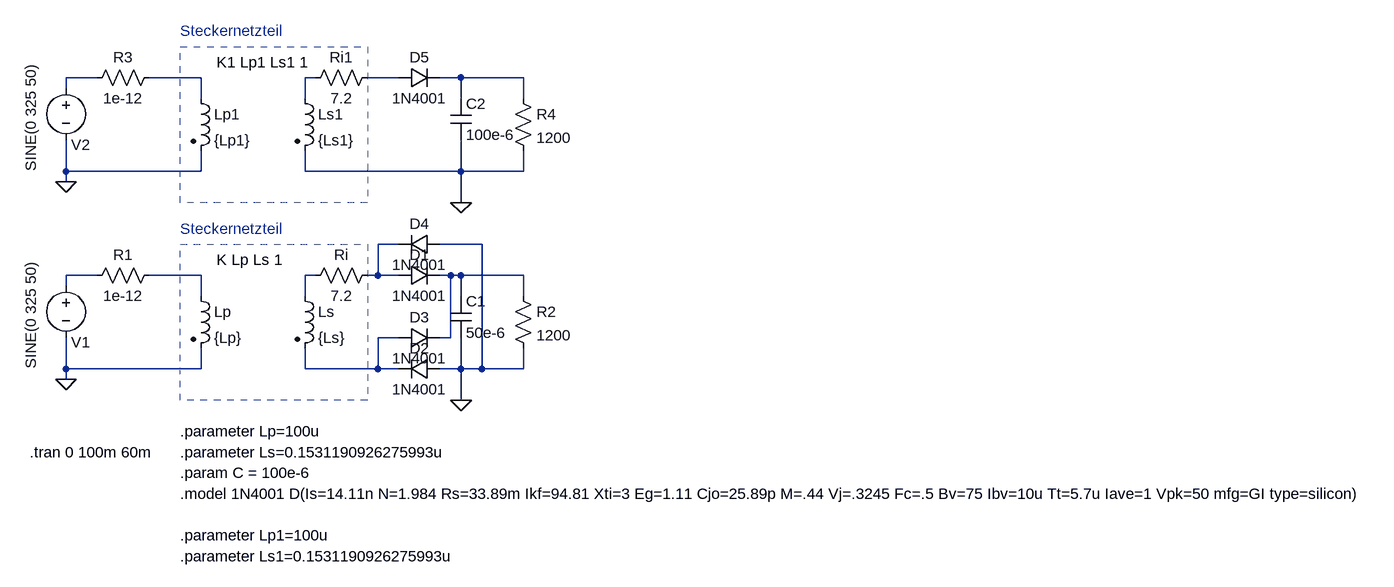
[diagram p0: schematic 102_lec_exercise_diode_bruecke.asc]
102_lec_exercise_diode_bruecke.asc, the LTspice schematic file:
Version 4
SHEET 1 2120 680
WIRE -48 -256 -96 -256
WIRE 112 -256 32 -256
WIRE 288 -256 272 -256
WIRE 416 -256 368 -256
WIRE 512 -256 480 -256
WIRE 608 -256 512 -256
WIRE -96 -240 -96 -256
WIRE 112 -224 112 -256
WIRE 272 -224 272 -256
WIRE 512 -224 512 -256
WIRE 608 -224 608 -256
WIRE -96 -112 -96 -160
WIRE 112 -112 112 -144
WIRE 112 -112 -96 -112
WIRE 272 -112 272 -144
WIRE 512 -112 512 -160
WIRE 512 -112 272 -112
WIRE 608 -112 608 -144
WIRE 608 -112 512 -112
WIRE -96 -96 -96 -112
WIRE 512 -64 512 -112
WIRE 416 0 384 0
WIRE 544 0 480 0
WIRE -48 48 -96 48
WIRE 112 48 32 48
WIRE 288 48 272 48
WIRE 384 48 384 0
WIRE 384 48 368 48
WIRE 416 48 384 48
WIRE 496 48 480 48
WIRE 512 48 496 48
WIRE 608 48 512 48
WIRE -96 64 -96 48
WIRE 112 80 112 48
WIRE 272 80 272 48
WIRE 512 80 512 48
WIRE 608 80 608 48
WIRE 416 144 384 144
WIRE 496 144 496 48
WIRE 496 144 480 144
WIRE -96 192 -96 144
WIRE 112 192 112 160
WIRE 112 192 -96 192
WIRE 272 192 272 160
WIRE 384 192 384 144
WIRE 384 192 272 192
WIRE 416 192 384 192
WIRE 512 192 512 144
WIRE 512 192 480 192
WIRE 544 192 544 0
WIRE 544 192 512 192
WIRE 608 192 608 160
WIRE 608 192 544 192
WIRE -96 208 -96 192
WIRE 512 240 512 192
FLAG -96 208 0
FLAG 512 240 0
FLAG -96 -96 0
FLAG 512 -64 0
SYMBOL voltage -96 48 R0
WINDOW 0 8 103 Left 2
WINDOW 3 -54 144 VLeft 2
WINDOW 123 0 0 Left 2
WINDOW 39 0 0 Left 2
SYMATTR InstName V1
SYMATTR Value SINE(0 325 50)
SYMBOL ind2 96 64 R0
SYMATTR InstName Lp
SYMATTR Value {Lp}
SYMATTR Type ind
SYMBOL ind2 256 64 R0
SYMATTR InstName Ls
SYMATTR Value {Ls}
SYMATTR Type ind
SYMBOL res 48 32 R90
WINDOW 0 0 56 VBottom 2
WINDOW 3 32 56 VTop 2
SYMATTR InstName R1
SYMATTR Value 1e-12
SYMBOL res 384 32 R90
WINDOW 0 0 56 VBottom 2
WINDOW 3 32 56 VTop 2
SYMATTR InstName Ri
SYMATTR Value 7.2
SYMBOL diode 416 64 R270
WINDOW 0 32 32 VTop 2
WINDOW 3 0 32 VBottom 2
SYMATTR InstName D1
SYMATTR Value 1N4001
SYMBOL cap 496 80 R0
SYMATTR InstName C1
SYMATTR Value 50e-6
SYMBOL res 592 64 R0
SYMATTR InstName R2
SYMATTR Value 1200
SYMBOL diode 480 176 R90
WINDOW 0 0 32 VBottom 2
WINDOW 3 32 32 VTop 2
SYMATTR InstName D2
SYMATTR Value 1N4001
SYMBOL diode 416 160 R270
WINDOW 0 32 32 VTop 2
WINDOW 3 0 32 VBottom 2
SYMATTR InstName D3
SYMATTR Value 1N4001
SYMBOL diode 480 -16 R90
WINDOW 0 0 32 VBottom 2
WINDOW 3 32 32 VTop 2
SYMATTR InstName D4
SYMATTR Value 1N4001
SYMBOL voltage -96 -256 R0
WINDOW 0 8 103 Left 2
WINDOW 3 -54 144 VLeft 2
WINDOW 123 0 0 Left 2
WINDOW 39 0 0 Left 2
SYMATTR InstName V2
SYMATTR Value SINE(0 325 50)
SYMBOL ind2 96 -240 R0
SYMATTR InstName Lp1
SYMATTR Value {Lp1}
SYMATTR Type ind
SYMBOL ind2 256 -240 R0
SYMATTR InstName Ls1
SYMATTR Value {Ls1}
SYMATTR Type ind
SYMBOL res 48 -272 R90
WINDOW 0 0 56 VBottom 2
WINDOW 3 32 56 VTop 2
SYMATTR InstName R3
SYMATTR Value 1e-12
SYMBOL res 384 -272 R90
WINDOW 0 0 56 VBottom 2
WINDOW 3 32 56 VTop 2
SYMATTR InstName Ri1
SYMATTR Value 7.2
SYMBOL cap 496 -224 R0
SYMATTR InstName C2
SYMATTR Value 100e-6
SYMBOL res 592 -240 R0
SYMATTR InstName R4
SYMATTR Value 1200
SYMBOL diode 416 -240 R270
WINDOW 0 32 32 VTop 2
WINDOW 3 0 32 VBottom 2
SYMATTR InstName D5
SYMATTR Value 1N4001
TEXT 136 24 Left 2 !K Lp Ls 1
TEXT 80 -24 Left 2 ;Steckernetzteil
TEXT 80 288 Left 2 !.parameter Lp=100u
TEXT 80 320 Left 2 !.parameter Ls=0.1531190926275993u
TEXT -152 320 Left 2 !.tran 0 100m 60m
TEXT 80 352 Left 2 !.param C = 100e-6
TEXT 80 384 Left 2 !.model 1N4001 D(Is=14.11n N=1.984 Rs=33.89m Ikf=94.81 Xti=3 Eg=1.11 Cjo=25.89p M=.44 Vj=.3245 Fc=.5 Bv=75 Ibv=10u Tt=5.7u Iave=1 Vpk=50 mfg=GI type=silicon)
TEXT 136 -280 Left 2 !K1 Lp1 Ls1 1
TEXT 80 -328 Left 2 ;Steckernetzteil
TEXT 80 448 Left 2 !.parameter Lp1=100u
TEXT 80 480 Left 2 !.parameter Ls1=0.1531190926275993u
RECTANGLE Normal 368 240 80 0 2
RECTANGLE Normal 368 -64 80 -304 2

The netlist it stands for:
* 102_lec_exercise_diode_bruecke.asc
V1 N007 0 SINE(0 325 50)
Lp N008 0 {Lp}
Ls N009 N011 {Ls}
R1 N008 N007 1e-12
Ri N006 N009 7.2
D1 N006 N010 1N4001
C1 N010 0 50e-6
R2 N010 0 1200
D2 0 N011 1N4001
D3 N011 N010 1N4001
D4 0 N006 1N4001
V2 N001 0 SINE(0 325 50)
Lp1 N002 0 {Lp1}
Ls1 N003 0 {Ls1}
R3 N002 N001 1e-12
Ri1 N004 N003 7.2
C2 N005 0 100e-6
R4 N005 0 1200
D5 N004 N005 1N4001
.model D D
.lib standard.dio
K Lp Ls 1
* Steckernetzteil
.parameter Lp=100u
.parameter Ls=0.1531190926275993u
.tran 0 100m 60m
.param C = 100e-6
.model 1N4001 D(Is=14.11n N=1.984 Rs=33.89m Ikf=94.81 Xti=3 Eg=1.11 Cjo=25.89p M=.44 Vj=.3245 Fc=.5 Bv=75 Ibv=10u Tt=5.7u Iave=1 Vpk=50 mfg=GI type=silicon)
K1 Lp1 Ls1 1
* Steckernetzteil
.parameter Lp1=100u
.parameter Ls1=0.1531190926275993u
.backanno
.end